# Altium schematic sheet SPI 1.SchDoc: Temperature
size A4; Date: 04/19/2026; Author: Lanfroid-Nazac Guillaume; DrawnBy: Lanfroid-Nazac Guillaume; Revision: v1.0; SheetNumber: 1; SheetTotal: 7
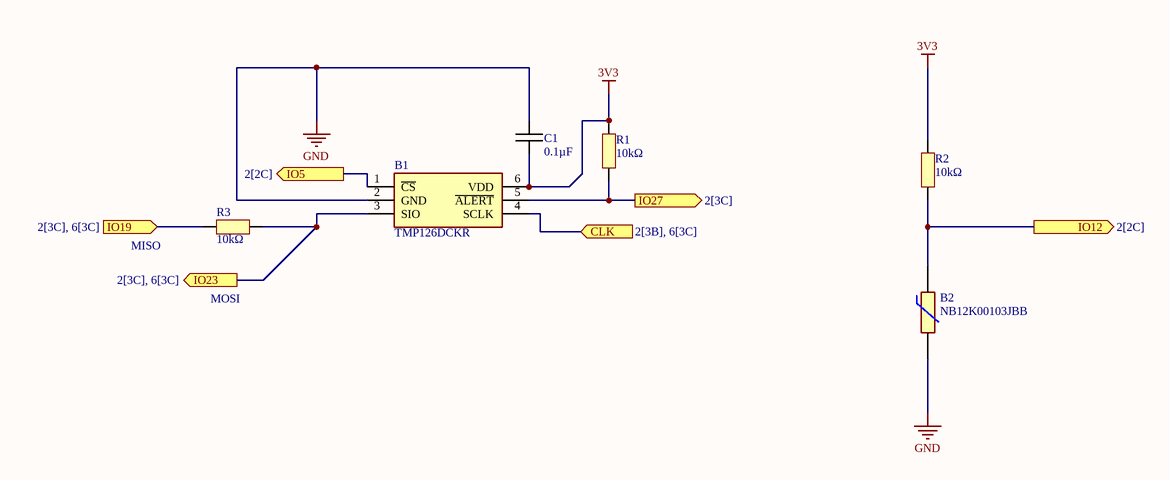
[diagram p0: SPI 1.SchDoc]

## Parts
B1  TMP126DCKR  [SOT65P210X110-6N]
B2  NB12K00103JBB  [RESC2212X50N]
C1  0.1µF  [CAPC1005X06N]
R1  10kΩ  [RESC1005X06N]
R2  10kΩ  [RESC1005X06N]
R3  10kΩ  [RESC1005X06N]

## Ports
CLK (in, see 2[3B], 6[3C]), IO5 (out, see 2[2C]), IO12 (out, see 2[2C]), IO19 (in, see 2[3C], 6[3C]), IO23 (out, see 2[3C], 6[3C]), IO27 (out, see 2[3C])

## Nets
3V3: B1.6(VDD) C1.1 R1.2 R2.1
GND: B1.2(GND) B2.2 C1.2
CLK: B1.4(SCLK) ; port CLK
IO5: B1.1(~{CS}) ; port IO5
IO12: B2.1 R2.2 ; port IO12
IO19: R3.2 ; port IO19
IO23: B1.3(SIO) R3.1 ; port IO23
IO27: B1.5(~{ALERT}) R1.1 ; port IO27

## Notes on the sheet
- MISO
- MOSI

## Library data of the parts
B1 = TMP126DCKR: Board Mount Temperature Sensors +/-0.25 C SPI temperature sensor with 175 C operation, CRC and slew-rate alert; Manufacturer_Name: Texas Instruments; Manufacturer_Part_Number: TMP126DCKR; Mouser Part Number: 595-TMP126DCKR
B2 = NB12K00103JBB: NTC SMD Thermistor, NB12K, 10K, 5% AVX 10k 0805 Protection NTC Thermistor, 5s, 2 x 1.25 x 1.3mm; Manufacturer_Name: Kyocera AVX; Geometry.Height: 0.5mm; Manufacturer_Part_Number: NB12K00103JBB; Mouser Part Number: 581-NB12K00103JBB; Mouser Price/Stock: https://www.mouser.co.uk/ProductDetail/AVX/NB12K00103JBB/?qs=4%252B6%252BTdINQeDPvI%252BQUQjJ3Q%3D%3D; Arrow Part Number: NB12K00103JBB; Arrow Price/Stock: https://www.arrow.com/en/products/nb12k00103jbb/avx; Datasheet Link: https://datasheet.datasheetarchive.com/originals/distributors/Datasheets-DGA6/551314.pdf
C1 = Capacitor
R1-R3 = Resistor